# EAGLE design 6way (EAGLE 5.12)
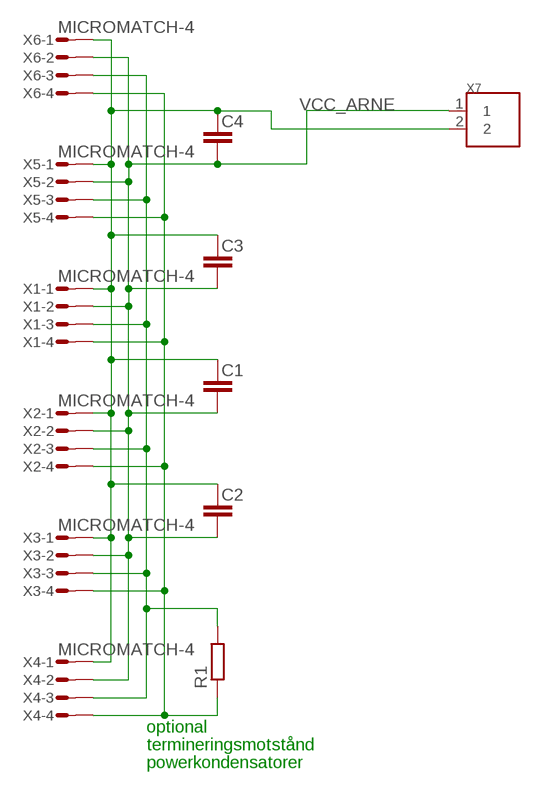
[diagram p0: schematic, sheet 1]

## Parts
C1  C-EU  [C0603]
C2  C-EU  [C0603]
C3  C-EU  [C0603]
C4  C-EU  [C0603]
R1  R-EUR0603  [R0603]
X1  MICROMATCH-4  [MICROMATCH-4]
X2  MICROMATCH-4  [MICROMATCH-4]
X3  MICROMATCH-4  [MICROMATCH-4]
X4  MICROMATCH-4  [MICROMATCH-4]
X5  MICROMATCH-4  [MICROMATCH-4]
X6  MICROMATCH-4  [MICROMATCH-4]
X7  BLOCK22.54  [PCB2]

## Nets
CANH: R1.1 X1.4 X2.4 X3.4 X4.4 X5.4 X6.4
CANL: R1.2 X1.3 X2.3 X3.3 X4.3 X5.3 X6.3
GND: C1.1 C2.1 C3.1 C4.1 X1.1 X2.1 X3.1 X4.1 X5.1 X6.1 X7.2
VCC_ARNE: C1.2 C2.2 C3.2 C4.2 X1.2 X2.2 X3.2 X4.2 X5.2 X6.2 X7.1

## Notes on the sheet
- optional
- termineringsmotstånd
- powerkondensatorer

## Library data of the parts
C1-C4 = rcl:C-EU
R1 = rcl:R-EU
X1-X6 = con-amp-micromatch:MICROMATCH-4: MicroMaTch 4 7-215464-4 / 0-215464-4 Drawing Number C-215464 DDEController.pdf
X7 = terminal_block:BLOCK2

## Board
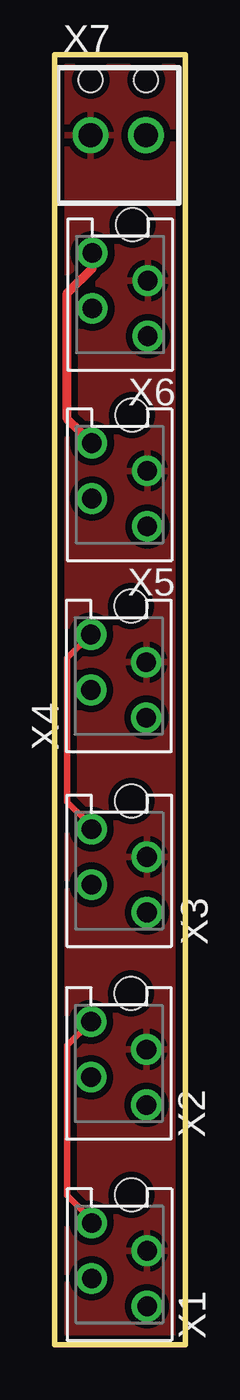
[diagram p1: board, top side]
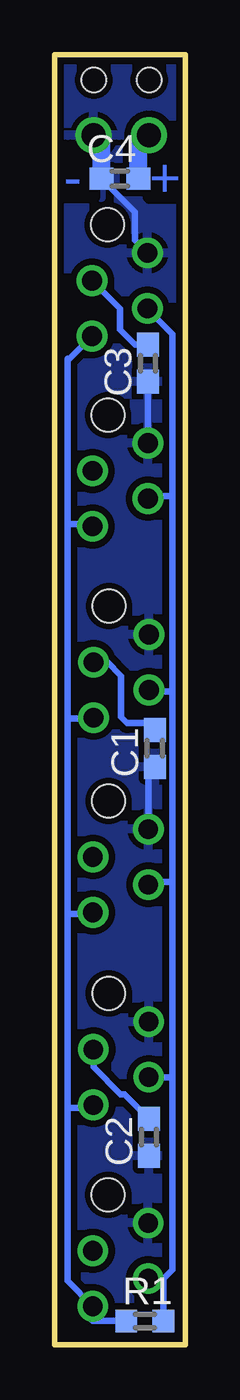
[diagram p2: board, bottom side, seen from below]

Size 6 x 59.08 mm. Coordinates in mm from the lower left corner, seen from the top.
Outline: 6,0 6,59.08 0,59.08 0,0 6,0
Copper layers (1*16): Top 0.035mm / dielectric 1.5mm / Bottom 0.035mm
Design rules "ITead_rule *": minimum track width 6mil, minimum drill 12mil, track to track 6mil, track to pad 6mil, pad to pad 6mil, via to via 6mil, smd to smd 0mil, copper to edge 10mil, drill to drill 10mil, minimum pad ring 10mil, minimum via ring 6mil, stop-mask expansion 2mil, vias tented up to drill 100mil, thermal gap 10mil

### Footprints (pad centres in the part's own frame; a part is rotated, then mirrored left to right if it is on the bottom)
C0603 = smd 1.1 x 1: 1 -0.85,0; 2 0.85,0
R0603 = smd 0.991 x 1.016: 1 -0.85,0; 2 0.85,0
MICROMATCH-4 = drill 0.9 round: 1 1.905,1.27; 2 0.635,-1.27; 3 -0.635,1.27; 4 -1.905,-1.27 | hole 1.5: 3.199,-0.562
PCB2 = drill 1.1 round: 1 -2.54,0; 2 0,0 | hole 1.1: -2.54,2.54; 0,2.54

### Placement (x,y rotation side)
C1  1.4,27.31 90 bottom
C2  1.66,9.51 90 bottom
C3  1.71,44.95 90 bottom
C4  3,53.39 0 bottom
R1  1.86,1.09 0 bottom
X1  2.97,3.68 90 top
X2  2.95,12.89 90 top
X3  2.97,21.71 90 top
X4  2.94,30.62 90 top
X5  2.98,39.38 90 top
X6  3.01,48.09 90 top
X7  4.2,55.38 0 top

### Tracks (layer width: path | path; a pad name or v marks a point on that pad's centre or on a via)
CANH
  Bottom 0.305: R1.1 4.24,1.09 X1.4 5.41,2.94 5.41,10.85 | 5.41,10.85 5.41,19.74 | 5.41,19.74 5.41,28.68 | 5.41,28.68 5.41,37.59 | 5.41,37.59 5.41,45.16 5.3,45.16 X6.4 | X5.4 4.37,37.59 5.41,37.59 | X4.4 4.25,28.68 5.41,28.68 | X3.4 4.3,19.74 5.41,19.74 | X2.4 4.36,10.85 5.41,10.85
CANL
  Bottom 0.305: 1.01,3.04 X1.3 | R1.2 1.01,3.04 | 0.58,12.24 0.58,3.43 0.97,3.04 1.01,3.04 | 0.58,12.24 0.58,21.21 | 0.58,21.21 0.58,29.92 | 0.58,29.92 0.58,38.86 | 0.58,38.86 0.58,46.28 1.74,47.43 X6.3 | X2.3 1.66,12.24 0.58,12.24 | X3.3 1.56,21.21 0.58,21.21 | X4.3 1.6,29.92 0.58,29.92 | X5.3 1.6,38.86 0.58,38.86
GND
  Top 0.305: X2.1 0.58,13.7 0.58,6.86 1.7,5.74 X1.1 | X4.1 0.58,31.44 0.58,24.87 1.7,23.75 X3.1
  Top 0.406: X6.1 1.74,49.31 0.58,48.16 0.58,42.39 X5.1
  Bottom 0.305: X5.1 | X5.1 C3.1 | X6.1 2.31,50.57 2.31,51.86 C4.1 | C1.1 1.7,26.05 X3.1
  Bottom 0.813: X7.2 3.85,55.03 C4.1
  pour Bottom (isolate 0.305): 0.3,0.3 0.3,58.78 5.7,58.78 5.7,0.3
VCC_ARNE
  Bottom 0.305: X6.2 3,47.45 3,46.48 2.31,45.8 C3.2 | X4.2 3.57,31.26 2.95,30.63 2.95,28.75 2.67,28.47 1.55,28.47 1.4,28.31 C1.2 | C2.2 2.79,11.48 2.97,11.48 4.22,12.73 X2.2
  Bottom 0.813: X7.1 2.15,54.89 C4.2
  pour Top (isolate 0.305): 0.3,0.3 0.3,58.78 5.7,58.78 5.7,0.3

### Text on the board
Bottom: + | -